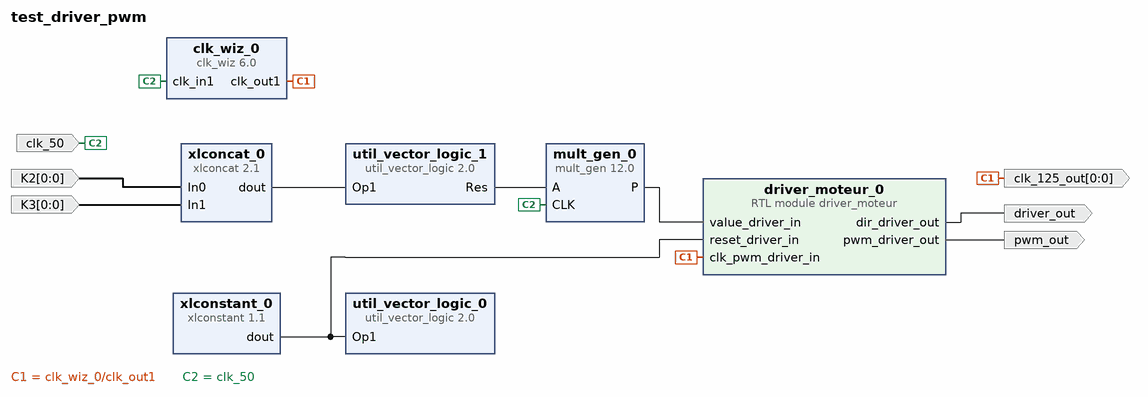
[diagram p0: block diagram of the top level]
# Vivado block design test_driver_pwm, xc7z010clg400-1, Vivado 2020.2
create_bd_design test_driver_pwm

create_bd_port -dir O driver_out
create_bd_port -dir O pwm_out
create_bd_port -dir I -type clk clk_50
set_property -dict {CONFIG.FREQ_HZ 50000000} [get_bd_ports clk_50]
create_bd_port -dir I -from 0 -to 0 K2
create_bd_port -dir I -from 0 -to 0 K3
create_bd_port -dir O -from 0 -to 0 clk_125_out

create_bd_cell -type ip -vlnv xilinx.com:ip:xlconstant:1.1 xlconstant_0
set_property -dict {CONFIG.CONST_VAL 0} [get_bd_cells xlconstant_0]
create_bd_cell -type ip -vlnv xilinx.com:ip:util_vector_logic:2.0 util_vector_logic_0
set_property -dict {CONFIG.C_OPERATION not CONFIG.C_SIZE 1} [get_bd_cells util_vector_logic_0]
create_bd_cell -type ip -vlnv xilinx.com:ip:clk_wiz:6.0 clk_wiz_0
set_property -dict [list \
  CONFIG.CLKIN1_JITTER_PS 200.0 \
  CONFIG.CLKOUT1_DRIVES BUFG \
  CONFIG.CLKOUT1_JITTER 238.699 \
  CONFIG.CLKOUT1_PHASE_ERROR 254.101 \
  CONFIG.CLKOUT1_REQUESTED_OUT_FREQ 125 \
  CONFIG.CLKOUT2_DRIVES BUFG \
  CONFIG.CLKOUT2_REQUESTED_OUT_FREQ 50 \
  CONFIG.CLKOUT3_DRIVES BUFG \
  CONFIG.CLKOUT3_REQUESTED_OUT_FREQ 50 \
  CONFIG.CLKOUT4_DRIVES BUFG \
  CONFIG.CLKOUT4_REQUESTED_OUT_FREQ 50 \
  CONFIG.CLKOUT5_DRIVES BUFG \
  CONFIG.CLKOUT5_REQUESTED_OUT_FREQ 50 \
  CONFIG.CLKOUT6_DRIVES BUFG \
  CONFIG.CLKOUT6_REQUESTED_OUT_FREQ 50 \
  CONFIG.CLKOUT7_DRIVES BUFG \
  CONFIG.CLKOUT7_REQUESTED_OUT_FREQ 50 \
  CONFIG.FEEDBACK_SOURCE FDBK_AUTO \
  CONFIG.MMCM_BANDWIDTH OPTIMIZED \
  CONFIG.MMCM_CLKFBOUT_MULT_F 35 \
  CONFIG.MMCM_CLKIN1_PERIOD 20.000 \
  CONFIG.MMCM_CLKIN2_PERIOD 10.0 \
  CONFIG.MMCM_CLKOUT0_DIVIDE_F 7 \
  CONFIG.MMCM_COMPENSATION ZHOLD \
  CONFIG.MMCM_DIVCLK_DIVIDE 2 \
  CONFIG.PLL_CLKIN_PERIOD 20.000 \
  CONFIG.PRIMITIVE PLL \
  CONFIG.PRIM_IN_FREQ 50 \
  CONFIG.PRIM_SOURCE Single_ended_clock_capable_pin \
  CONFIG.SECONDARY_SOURCE Single_ended_clock_capable_pin \
  CONFIG.USE_FREQ_SYNTH true \
  CONFIG.USE_LOCKED false \
  CONFIG.USE_PHASE_ALIGNMENT false \
  CONFIG.USE_RESET false \
] [get_bd_cells clk_wiz_0]
create_bd_cell -type ip -vlnv xilinx.com:ip:xlconcat:2.1 xlconcat_0
set_property -dict {CONFIG.IN0_WIDTH 1 CONFIG.IN1_WIDTH 1 CONFIG.NUM_PORTS 2} [get_bd_cells xlconcat_0]
create_bd_cell -type ip -vlnv xilinx.com:ip:mult_gen:12.0 mult_gen_0
set_property -dict [list \
  CONFIG.ClockEnable false \
  CONFIG.ConstValue 2083 \
  CONFIG.MultType Constant_Coefficient_Multiplier \
  CONFIG.OutputWidthHigh 31 \
  CONFIG.PortAType Unsigned \
  CONFIG.PortAWidth 2 \
  CONFIG.Use_Custom_Output_Width true \
] [get_bd_cells mult_gen_0]
create_bd_cell -type ip -vlnv xilinx.com:ip:util_vector_logic:2.0 util_vector_logic_1
set_property -dict {CONFIG.C_OPERATION not CONFIG.C_SIZE 2} [get_bd_cells util_vector_logic_1]
create_bd_cell -type module -reference driver_moteur driver_moteur_0

# ---- connections ----

connect_bd_net [get_bd_pins driver_moteur_0/dir_driver_out] [get_bd_ports driver_out]
connect_bd_net [get_bd_pins driver_moteur_0/pwm_driver_out] [get_bd_ports pwm_out]
connect_bd_net [get_bd_pins xlconstant_0/dout] [get_bd_pins util_vector_logic_0/Op1] [get_bd_pins driver_moteur_0/reset_driver_in]
connect_bd_net [get_bd_pins clk_wiz_0/clk_out1] [get_bd_ports clk_125_out] [get_bd_pins driver_moteur_0/clk_pwm_driver_in]
connect_bd_net [get_bd_pins mult_gen_0/P] [get_bd_pins driver_moteur_0/value_driver_in]
connect_bd_net -net bit30_in_1 [get_bd_ports K2] [get_bd_pins xlconcat_0/In0]
connect_bd_net -net bit31_in_1 [get_bd_ports K3] [get_bd_pins xlconcat_0/In1]
connect_bd_net [get_bd_pins xlconcat_0/dout] [get_bd_pins util_vector_logic_1/Op1]
connect_bd_net [get_bd_pins util_vector_logic_1/Res] [get_bd_pins mult_gen_0/A]
connect_bd_net [get_bd_ports clk_50] [get_bd_pins clk_wiz_0/clk_in1] [get_bd_pins mult_gen_0/CLK]

validate_bd_design
save_bd_design
